# EAGLE design Coinmech-Programmer (EAGLE 6.6.0)
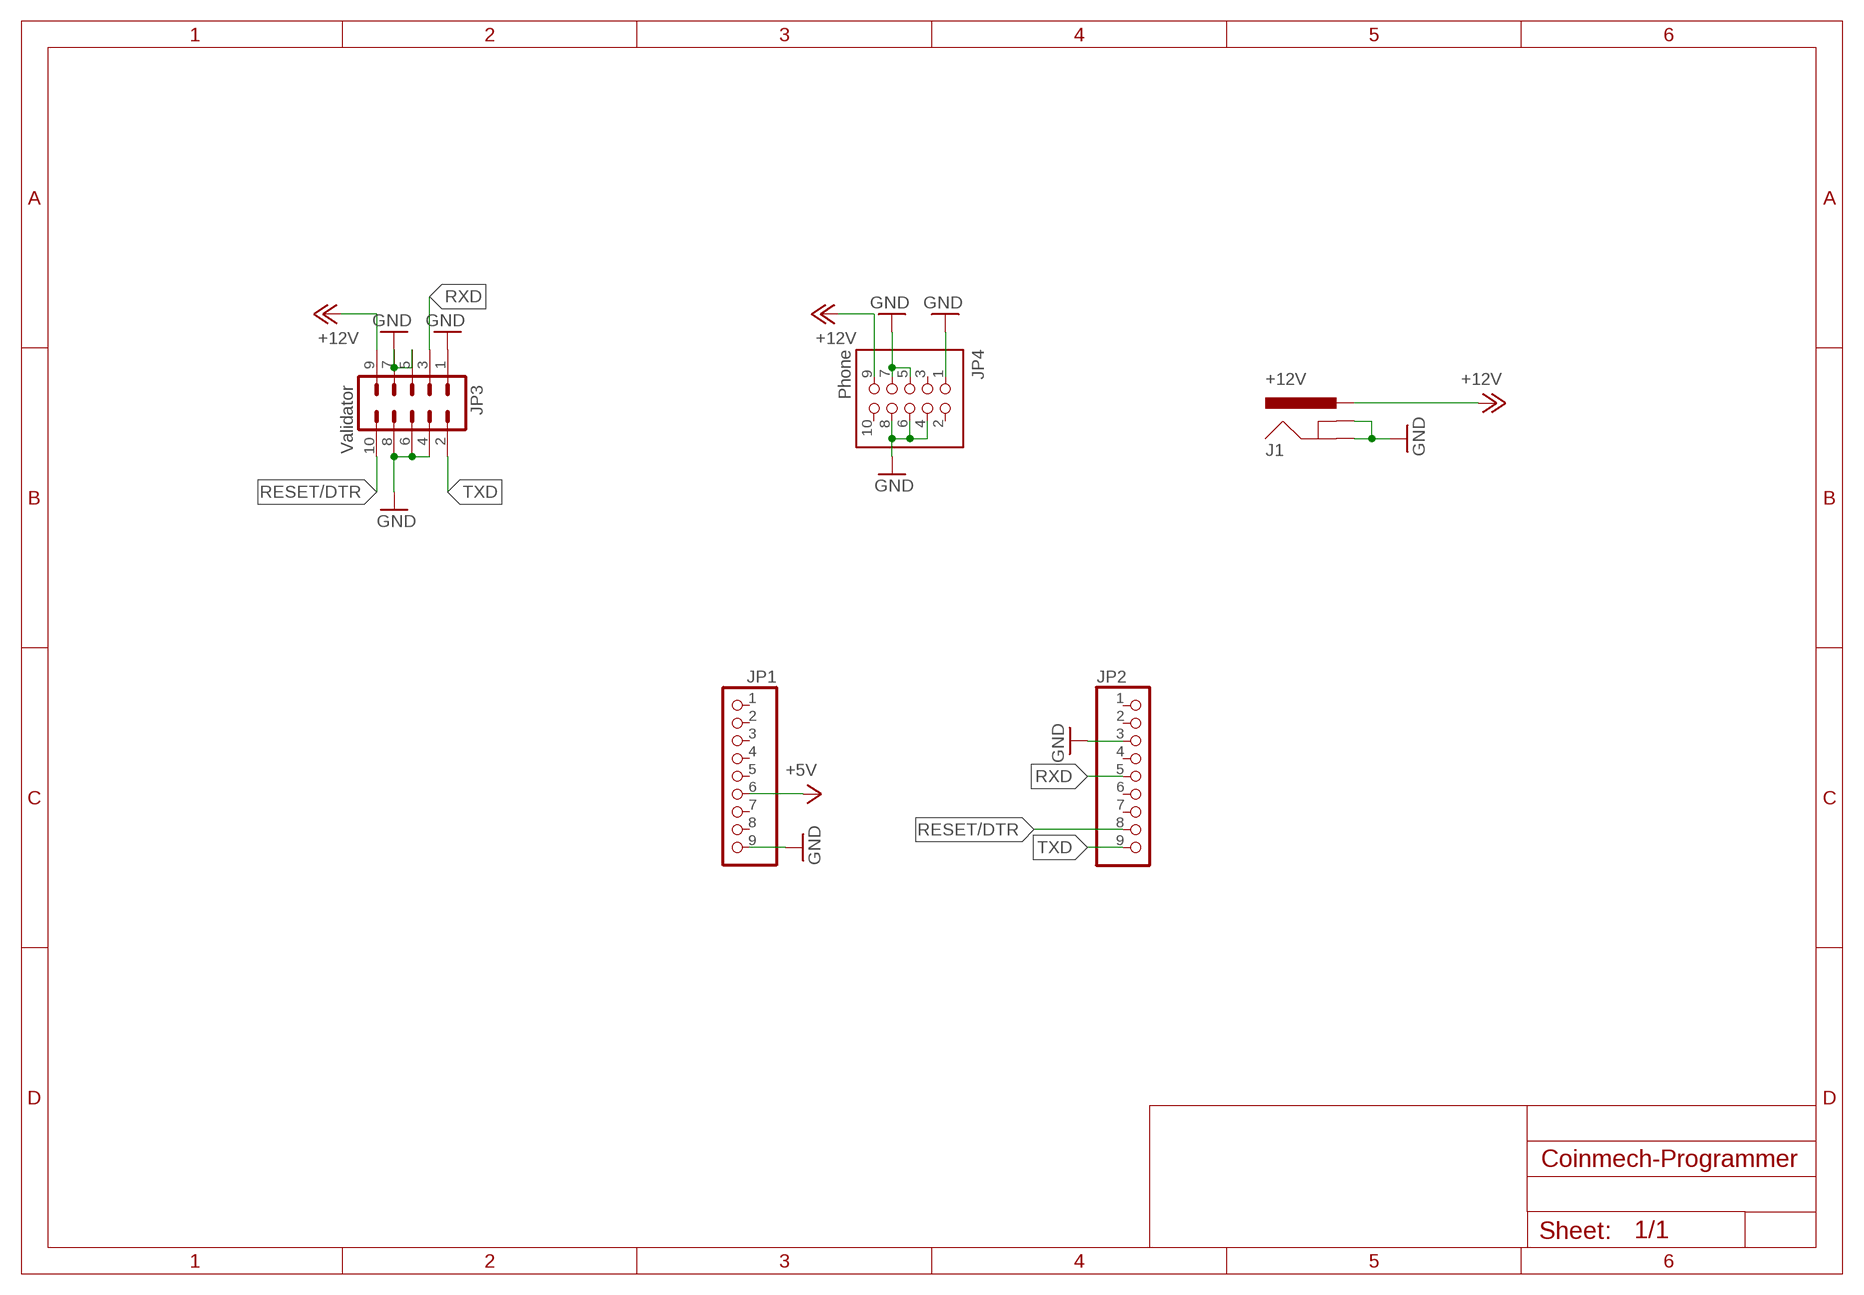
[diagram p0: schematic, sheet 1]

## Parts
J1  +12V  POWER_JACKPTH  [POWER_JACK_PTH]
JP1  PINHD-1X9  [1X09]
JP2  PINHD-1X9  [1X09]
JP3  Validator  M05X2SHD  [2X5-SHROUDED]
JP4  Phone  PINHD-2X5  [2X05]

## Nets
+5V: JP1.6
+12V: J1.PWR JP3.9 JP4.9
GND: J1.GND J1.GNDBREAK JP1.9 JP2.3 JP3.1 JP3.4 JP3.5 JP3.6 JP3.7 JP3.8 JP4.1 JP4.4 JP4.5 JP4.6 JP4.7 JP4.8
RESET/DTR: JP2.8 JP3.10
RXD: JP2.5 JP3.3
TXD: JP2.9 JP3.2
Unconnected: JP1.1 JP1.2 JP1.3 JP1.4 JP1.5 JP1.7 JP1.8 JP2.1 JP2.2 JP2.4 JP2.6 JP2.7 JP4.2 JP4.3 JP4.10

## Library data of the parts
J1 = SparkFun-Connectors:POWER_JACK: Power Jack This is the standard 5.5mm barrel jack for power. The PTH is the most common, proven, reliable, footprint. The Slot footprint only works if the mill layer is transmitted to the PCB fab house so be warned. Mating wall wart : TOL-00298 (and others); PROD_ID: CONN-08197
JP1 JP2 = pinhead:PINHD-1X9: PIN HEADER
JP3 = SparkFun-Connectors:M05X2: Header 5x2 Standard 10-pin dual row 0.1" header. Commonly used with AVR-ISP. Use with Spark Fun Electronics SKU: PRT-00778
JP4 = pinhead-edge:PINHD-2X5

## Board
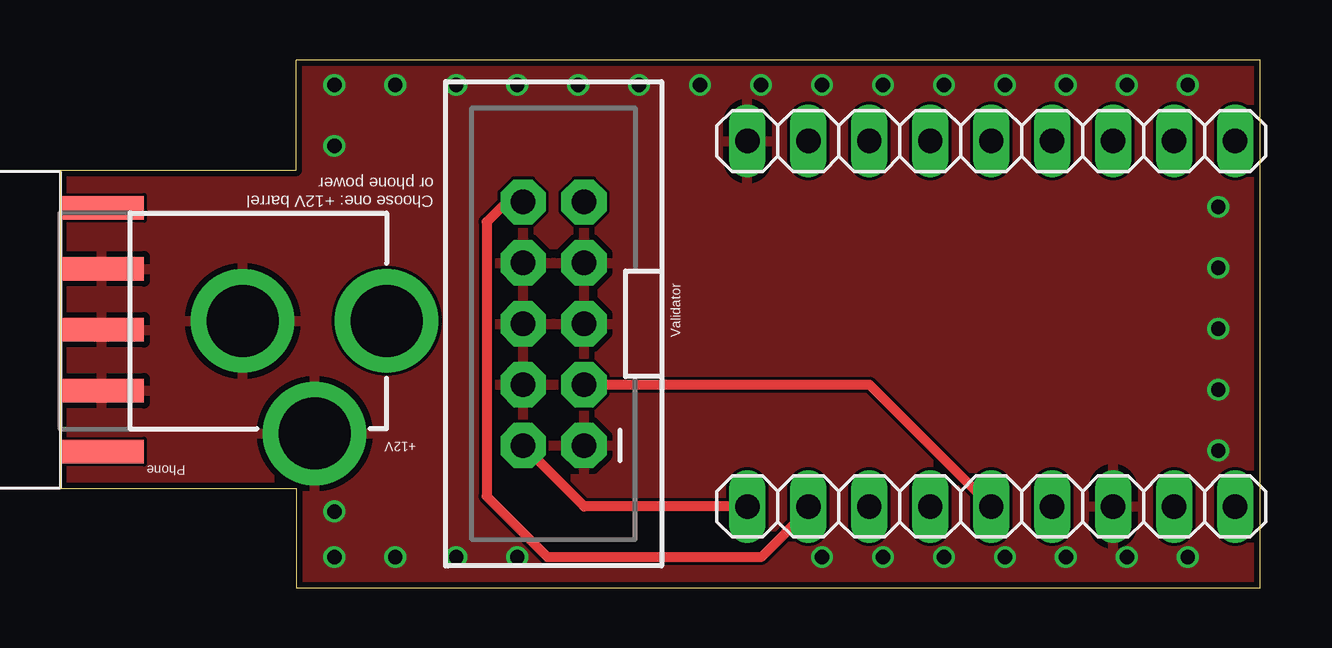
[diagram p1: board, top side]
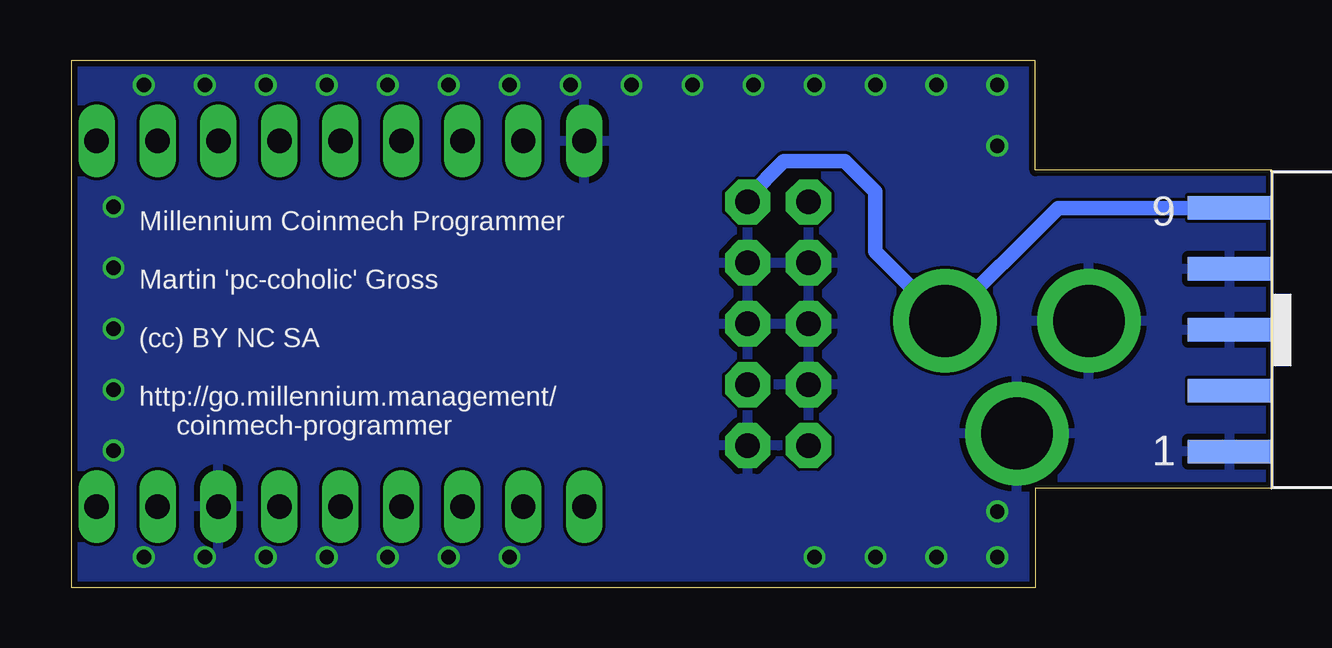
[diagram p2: board, bottom side, seen from below]

Size 50 x 22 mm. Coordinates in mm from the lower left corner, seen from the top.
Outline: 9.84,0 50,0 50,22 9.84,22 9.84,17.4 0,17.4 0,4.13 9.84,4.13 9.84,0
Copper layers (1*16): Top 0.035mm / dielectric 1.5mm / Bottom 0.035mm
Design rules "dirt_cheap_dirty_boards.v1": minimum track width 5mil, minimum drill 12mil, track to track 5mil, track to pad 5mil, pad to pad 5mil, via to via 5mil, smd to smd 0mil, copper to edge 10mil, drill to drill 10mil, minimum pad ring 10mil, minimum via ring 6mil, stop-mask expansion 2mil, vias tented up to drill 25mil, thermal gap 10mil

### Footprints (pad centres in the part's own frame; a part is rotated, then mirrored left to right if it is on the bottom)
POWER_JACK_PTH = drill 2.997 pad 4.318: GND 0,7.7; GNDBREAK 4.7,10.7; PWR 0,13.7
1X09 = drill 1.016 long: 1 -10.16,0; 2 -7.62,0; 3 -5.08,0; 4 -2.54,0; 5 0,0; 6 2.54,0; 7 5.08,0; 8 7.62,0; 9 10.16,0
2X5-SHROUDED = drill 1.016 pad 1.88 octagon: 1 -1.27,5.08; 2 1.27,5.08; 3 -1.27,2.54; 4 1.27,2.54; 5 -1.27,0; 6 1.27,0; 7 -1.27,-2.54; 8 1.27,-2.54; 9 -1.27,-5.08; 10 1.27,-5.08
2X05 = smd 3.48 x 0.991: 1 5.56,5.33; 3 5.56,2.79; 5 5.56,0.25; 7 5.56,-2.29; 9 5.56,-4.83 | smd 3.48 x 0.991 bottom: 2 5.56,5.33; 4 5.56,2.79; 6 5.56,0.25; 8 5.56,-2.29; 10 5.56,-4.83

### Placement (x,y rotation side)
J1  -0.09,11.12 270 top
JP1  38.8,18.62 180 top
JP2  38.8,3.38 180 top
JP3  20.57,11 180 top
JP4  -3.81,11 180 bottom

### Tracks (layer width: path | path; a pad name or v marks a point on that pad's centre or on a via)
+12V
  Bottom 0.61: JP4.9 8.9,15.83 J1.PWR 16.51,14.02 16.51,16.51 17.78,17.78 20.32,17.78 21.84,16.27 JP3.9
GND  (via drill 0.6)
  Bottom 0.406: JP4.8 | JP4.1 3.02,5.67 3.02,5.66
  other vias: 11.43,20.95 11.43,18.41 11.43,1.27 11.43,3.17 13.97,1.27 16.51,1.27 19.05,1.27 31.75,1.27 34.29,1.27 36.83,1.27 39.37,1.27 41.91,1.27 44.45,1.27 46.99,1.27 48.26,5.71 13.97,20.95 16.51,20.95 19.05,20.95 21.59,20.95 24.13,20.95 46.99,20.95 44.45,20.95 41.91,20.95 39.37,20.95 36.83,20.95 34.29,20.95 26.67,20.95 29.21,20.95 31.75,20.95 48.26,8.26 48.26,10.79 48.26,13.34 48.26,15.88
  pour Top: -10.16,24.13 -10.16,-2.54 50.8,-2.54 50.8,24.13
  pour Bottom: -10.16,24.13 50.8,24.13 50.8,-2.54 -10.16,-2.54
RESET/DTR
  Top 0.406: JP3.10 18.62,16.08 17.78,15.24 17.78,3.81 18.41,3.17 19.05,2.54 20.32,1.27 29.21,1.27 31.18,3.24 JP2.8
RXD
  Top 0.406: JP3.3 33.72,8.46 JP2.5
TXD
  Top 0.406: JP2.9 21.84,3.38 JP3.2

### Text on the board
tPlace: Choose one: +12V barrel / or phone power
bPlace: Millennium Coinmech Programmer / / Martin 'pc-coholic' Gross / / (cc) BY NC SA / / http://go.millennium.management/ / coinmech-programmer